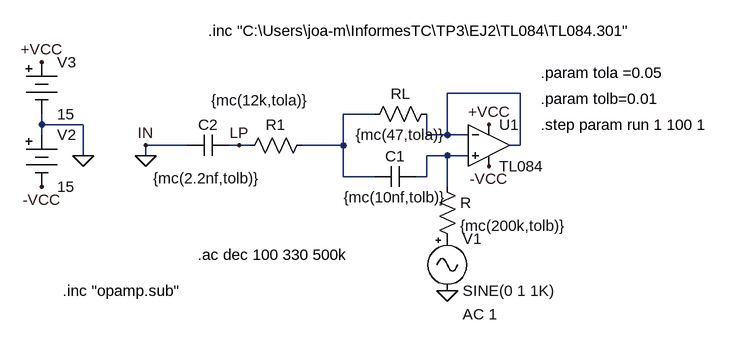
[diagram p0: schematic gyrator_lowpass_montecarlo.asc]
gyrator_lowpass_montecarlo.asc, the LTspice schematic file:
Version 4
SHEET 1 880 680
WIRE 192 80 80 80
WIRE -32 112 -80 112
WIRE -544 128 -544 112
WIRE -480 128 -544 128
WIRE -544 144 -544 128
WIRE 48 144 48 112
WIRE 80 144 80 80
WIRE 80 144 48 144
WIRE 112 144 80 144
WIRE -320 160 -384 160
WIRE -240 160 -256 160
WIRE -224 160 -240 160
WIRE -80 160 -80 112
WIRE -80 160 -144 160
WIRE 192 160 192 80
WIRE 192 160 176 160
WIRE -480 176 -480 128
WIRE -384 176 -384 160
WIRE 80 176 48 176
WIRE 112 176 80 176
WIRE -80 208 -80 160
WIRE -32 208 -80 208
WIRE 48 208 48 176
WIRE 48 208 32 208
WIRE 80 224 80 176
FLAG 80 384 0
FLAG -384 176 0
FLAG -544 32 +VCC
FLAG -544 224 -VCC
FLAG -480 176 0
FLAG -384 160 IN
FLAG 144 128 +VCC
FLAG 144 192 -VCC
FLAG -240 160 LP
SYMBOL res 64 96 R90
WINDOW 0 0 56 VBottom 2
WINDOW 3 32 56 VTop 2
SYMATTR InstName RL
SYMATTR Value {mc(47,tola)}
SYMBOL res 64 208 R0
SYMATTR InstName R
SYMATTR Value {mc(200k,tolb)}
SYMBOL cap 32 192 R90
WINDOW 0 0 32 VBottom 2
WINDOW 3 32 32 VTop 2
SYMATTR InstName C1
SYMATTR Value {mc(10nf,tolb)}
SYMBOL res -128 144 R90
WINDOW 0 0 56 VBottom 2
WINDOW 3 -69 80 VTop 2
SYMATTR InstName R1
SYMATTR Value {mc(12k,tola)}
SYMBOL cap -256 144 R90
WINDOW 0 0 32 VBottom 2
WINDOW 3 51 34 VTop 2
SYMATTR InstName C2
SYMATTR Value {mc(2.2nf,tolb)}
SYMBOL Misc\\signal 80 288 R0
WINDOW 123 24 132 Left 2
WINDOW 39 0 0 Left 0
SYMATTR Value2 AC 1
SYMATTR InstName V1
SYMBOL Misc\\battery -544 128 R0
WINDOW 123 0 0 Left 0
WINDOW 39 0 0 Left 0
SYMATTR InstName V2
SYMATTR Value 15
SYMBOL Misc\\battery -544 16 R0
WINDOW 123 0 0 Left 0
WINDOW 39 0 0 Left 0
SYMATTR InstName V3
SYMATTR Value 15
SYMBOL Opamps\\opamp2 144 96 R0
SYMATTR InstName U1
SYMATTR Value TL084
SYMATTR SpiceModel TL084
TEXT -304 328 Left 2 !.ac dec 100 330 500k
TEXT -288 -16 Left 2 !.inc "C:\\Users\\joa-m\\InformesTC\\TP3\\EJ2\\TL084\\TL084.301"
TEXT -512 384 Left 2 !.inc "opamp.sub"
TEXT 224 48 Left 2 !.param tola =0.05
TEXT 224 88 Left 2 !.param tolb=0.01
TEXT 224 128 Left 2 !.step param run 1 100 1

The netlist it stands for:
* gyrator_lowpass_montecarlo.asc
RL N001 N002 {mc(47,tola)}
R N003 P001 {mc(200k,tolb)}
C1 N003 N002 {mc(10nf,tolb)}
R1 N002 LP {mc(12k,tola)}
C2 LP 0 {mc(2.2nf,tolb)}
V1 P001 0 SINE(0 1 1K) AC 1
V2 0 -VCC 15
V3 +VCC 0 15
XU1 N003 N001 +VCC -VCC N001 TL084 TL084  ; pins In+ In- V+ V- OUT
.ac dec 100 330 500k
.inc "C:\Users\joa-m\InformesTC\TP3\EJ2\TL084\TL084.301"
.inc "opamp.sub"
.param tola =0.05
.param tolb=0.01
.step param run 1 100 1
.backanno
.end